# EAGLE design Power Tail Breakout (EAGLE 8.1.1)
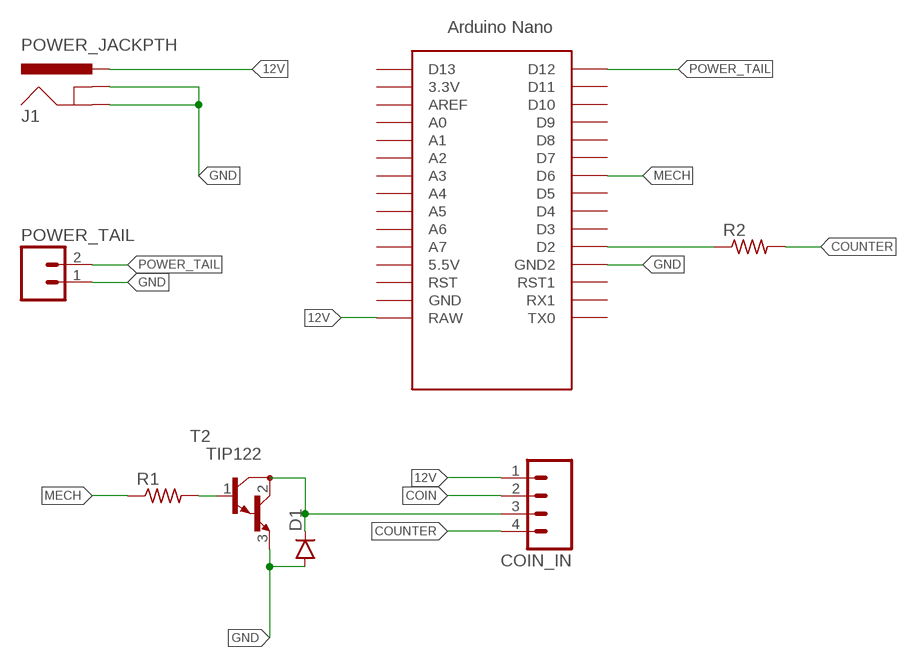
[diagram p0: schematic, sheet 1]

## Parts
COIN_IN  M041X04_NO_SILK  [1X04_NO_SILK]
D1  DIODEPTH  [DIODE-1N4001]
J1  POWER_JACKPTH  [POWER_JACK_PTH]
POWER_TAIL  M02LOCK_LONGPADS  [1X02_LOCK_LONGPADS]
R1  R-US_0411/3V  [0411V]
R2  R-US_0411/3V  [0411V]
T2  TIP122  [TO220]
U$1  NANO  [NANO]

## Nets
12V: COIN_IN.1 J1.PWR U$1.RAW
COIN: COIN_IN.2
COUNTER: COIN_IN.4 R2.2
GND: D1.A J1.GND J1.GNDBREAK POWER_TAIL.1 T2.3(E) U$1.GND1(GND2)
MECH: R1.1 U$1.D6
N$1: COIN_IN.3 D1.C T2.2(C)
N$2: R1.2 T2.1(B)
N$3: R2.1 U$1.D2
POWER_TAIL: POWER_TAIL.2 U$1.D12
Unconnected: U$1.3.3V U$1.5V(5.5V) U$1.A0 U$1.A1 U$1.A2 U$1.A3 U$1.A4 U$1.A5 U$1.A6 U$1.A7 U$1.AREF U$1.D3 U$1.D4 U$1.D5 U$1.D7 U$1.D8 U$1.D9 U$1.D10 U$1.D11 U$1.D13 U$1.GND U$1.ICSP1 U$1.ICSP2 U$1.ICSP3 U$1.ICSP4 U$1.ICSP5 U$1.ICSP6 U$1.RST U$1.RST1 U$1.RX1 U$1.TX0

## Library data of the parts
COIN_IN = SparkFun:M04: Header 4 Standard 4-pin 0.1" header. Use with straight break away headers (SKU : PRT-00116), right angle break away headers (PRT-00553), swiss pins (PRT-00743), machine pins (PRT-00117), and female headers (PRT-00115). Molex polarized connector foot print use with SKU : PRT-08231 with associated crimp pins and housings.
D1 = SparkFun-DiscreteSemi:DIODE: Diode These are standard reverse protection diodes and small signal diodes. SMA package can handle up to about 1A. SOD-323 can handle about 200mA. What the SOD-323 package when ordering, there are some mfgs out there that are 5-pin packages.
J1 = SparkFun-Connectors:POWER_JACK: Power Jack This is the standard 5.5mm barrel jack for power. The PTH is the most common, proven, reliable, footprint. The Slot footprint only works if the mill layer is transmitted to the PCB fab house so be warned. Mating wall wart : TOL-00298 (and others); PROD_ID: CONN-08197
POWER_TAIL = SparkFun-Connectors:M02: Standard 2-pin 0.1" header. Use with - straight break away headers ( PRT-00116) - right angle break away headers (PRT-00553) - swiss pins (PRT-00743) - machine pins (PRT-00117) - female headers (PRT-00115) Molex polarized connector foot print use with: PRT-08233 with associated crimp pins and housings. 2.54_SCREWTERM for use with PRT-10571. 3.5mm Screw Terminal footprints for PRT-08084 5mm Screw Terminal footprints for use with PRT-08432
R1 R2 = adafruit:R-US_: RESISTOR, American symbol
T2 = transistor:TIP122: NPN BIPOLAR DARLINGTON TRANSISTOR
U$1 = Arduino-clone:NANO: Arduino Nano

## Board
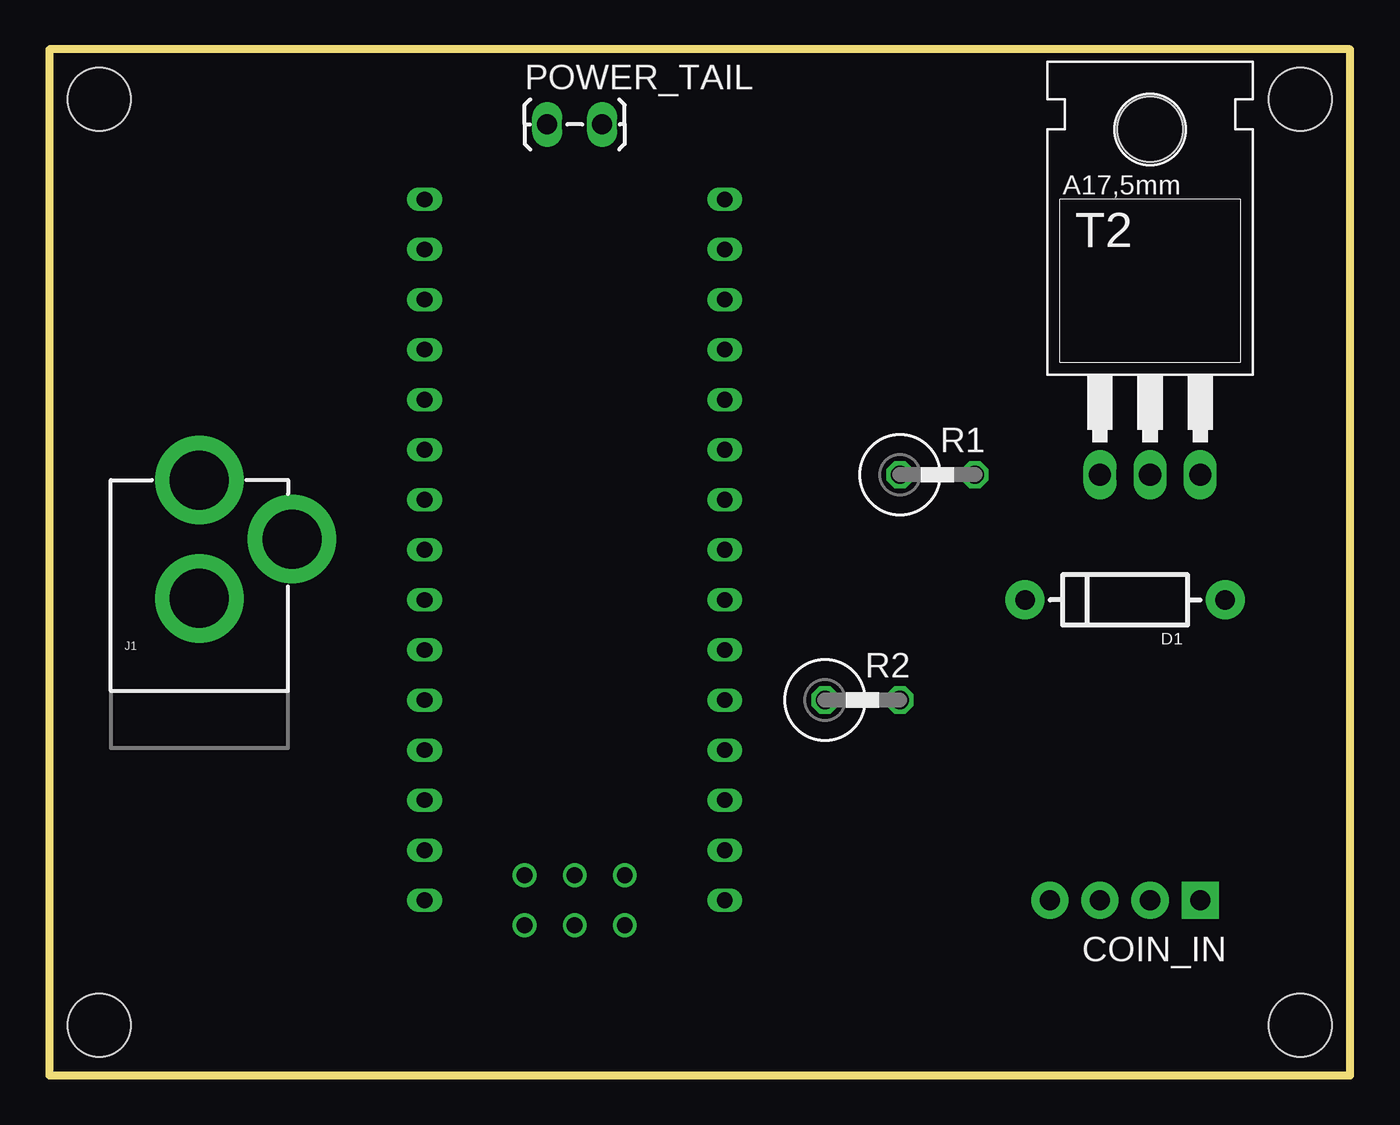
[diagram p1: board, top side]
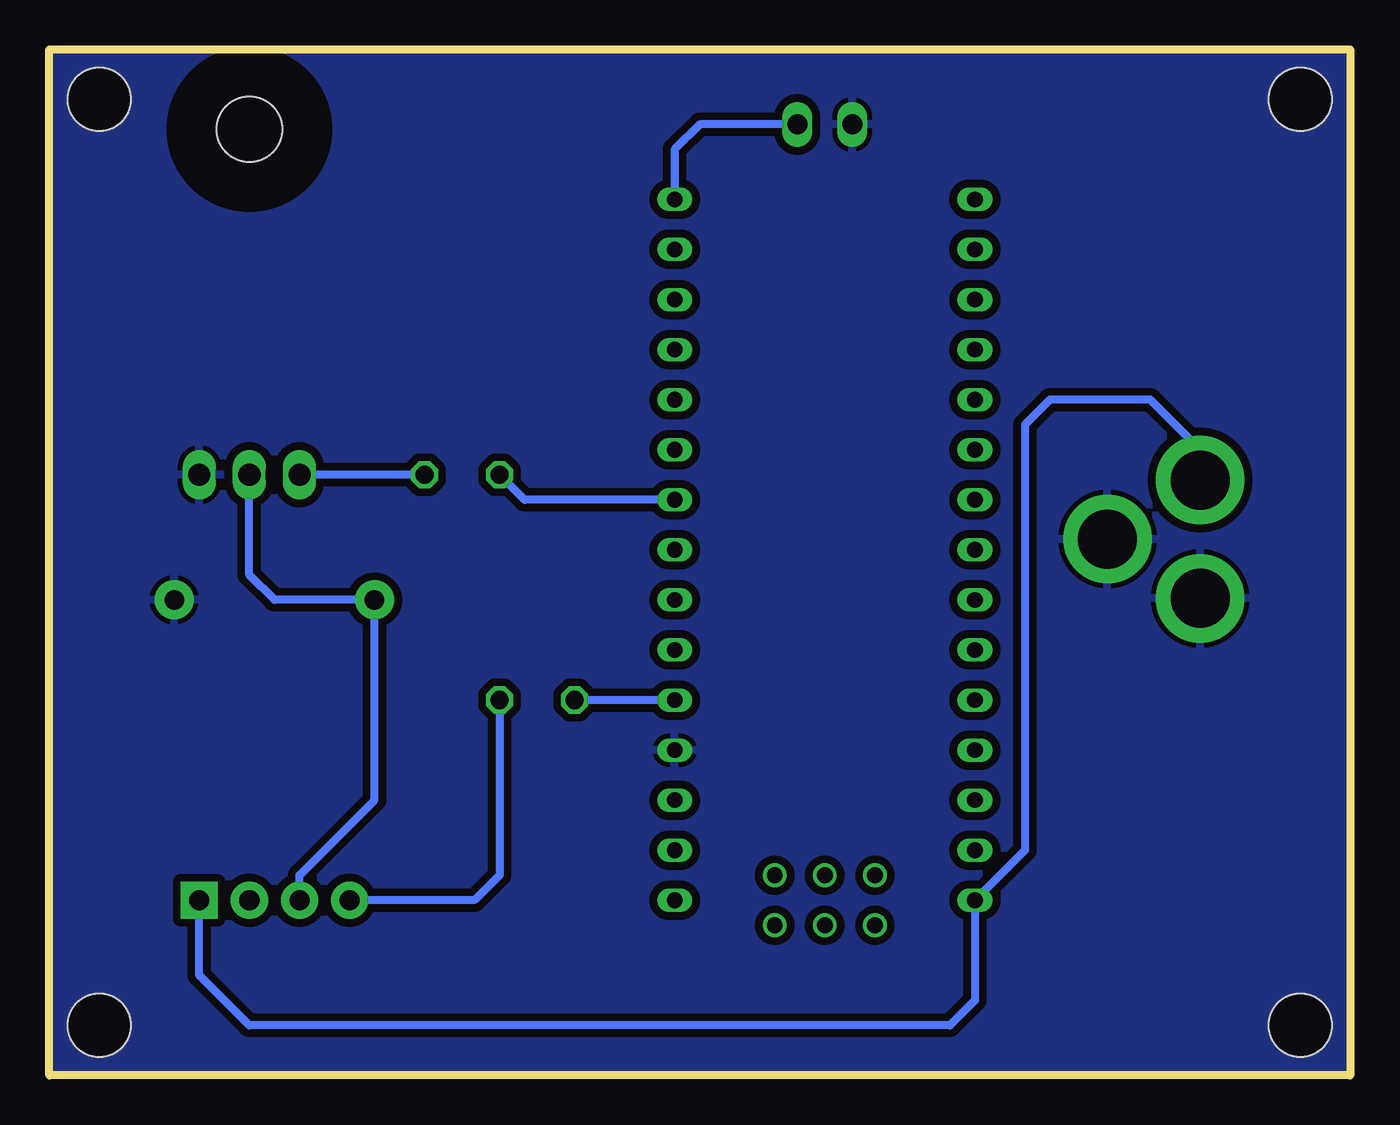
[diagram p2: board, bottom side, seen from below]

Size 66.04 x 52.07 mm. Coordinates in mm from the lower left corner, seen from the top.
Outline: 0,0 66.04,0 66.04,52.07 0,52.07 0,0
Copper layers (1*16): Top 0.035mm / dielectric 1.5mm / Bottom 0.035mm
Design rules "OthermillDRC_1_64_v2": minimum track width 16mil, minimum drill 31mil, track to track 0.39878125mm, track to pad 0.39878125mm, pad to pad 0.39878125mm, via to via 0.39878125mm, smd to smd 0mil, copper to edge 0mil, drill to drill 1mil, minimum pad ring 0mil, minimum via ring 15mil, stop-mask expansion 1mil, vias tented up to drill 30mil, thermal gap 10mil
Holes 3.2 mm at 2.54,49.53 63.5,49.53 63.5,2.54 2.54,2.54

### Footprints (pad centres in the part's own frame; a part is rotated, then mirrored left to right if it is on the bottom)
1X04_NO_SILK = drill 1.016 pad 1.88 square: 1 0,0 | drill 1.016 pad 1.88: 2 2.54,0; 3 5.08,0; 4 7.62,0
DIODE-1N4001 = drill 1 pad 1.981: A -5.08,0; C 5.08,0
POWER_JACK_PTH = drill 2.997 pad 4.318: GND 0,7.7; GNDBREAK 4.7,10.7; PWR 0,13.7
1X02_LOCK_LONGPADS = drill 1.016 long: 1 -0.127,0; 2 2.667,0
0411V = drill 0.914 octagon: 1 -2.54,0; 2 1.27,0
TO220 = drill 1.118 long: 1 -2.54,-6.35; 2 0,-6.35; 3 2.54,-6.35 | hole 3.302: 0,11.176
NANO = drill 0.8 long: 3.3V -10.16,24.13; 5V -10.16,-1.27; A0 -10.16,19.05; A1 -10.16,16.51; A2 -10.16,13.97; A3 -10.16,11.43; A4 -10.16,8.89; A5 -10.16,6.35; A6 -10.16,3.81; A7 -10.16,1.27; AREF -10.16,21.59; D2 5.08,1.27; D3 5.08,3.81; D4 5.08,6.35; D5 5.08,8.89; D6 5.08,11.43; D7 5.08,13.97; D8 5.08,16.51; D9 5.08,19.05; D10 5.08,21.59; D11 5.08,24.13; D12 5.08,26.67; D13 -10.16,26.67; GND -10.16,-6.35; GND1 5.08,-1.27; RAW -10.16,-8.89; RST -10.16,-3.81; RST1 5.08,-3.81; RX1 5.08,-6.35; TX0 5.08,-8.89 | drill 0.8: ICSP1 -5.08,-10.16; ICSP2 -5.08,-7.62; ICSP3 -2.54,-10.16; ICSP4 -2.54,-7.62; ICSP5 0,-10.16; ICSP6 0,-7.62

### Placement (x,y rotation side)
COIN_IN  58.42,8.89 180 top
D1  54.61,24.13 180 top
J1  7.62,16.51 0 top
POWER_TAIL  25.4,48.26 0 top
R1  45.72,30.48 0 top
R2  41.91,19.05 0 top
T2  55.88,36.83 0 top
U$1  29.21,17.78 0 top

### Tracks (layer width: path | path; a pad name or v marks a point on that pad's centre or on a via)
12V
  Bottom 0.406: J1.PWR 7.62,31.75 10.16,34.29 15.24,34.29 16.51,33.02 16.51,11.43 U$1.RAW 19.05,3.81 20.32,2.54 55.88,2.54 58.42,5.08 COIN_IN.1
COUNTER
  Bottom 0.406: R2.2 43.18,10.16 44.45,8.89 COIN_IN.4
GND
  pour Bottom: 0,0 66.04,0 66.04,52.07 0,52.07
MECH
  Bottom 0.406: U$1.D6 41.91,29.21 R1.1
N$1
  Bottom 0.406: T2.2 55.88,25.4 54.61,24.13 D1.C 49.53,13.97 53.34,10.16 COIN_IN.3
N$2
  Bottom 0.406: R1.2 T2.1
N$3
  Bottom 0.406: U$1.D2 R2.1
POWER_TAIL
  Bottom 0.406: POWER_TAIL.2 33.02,48.26 34.29,46.99 U$1.D12